# Altium schematic sheet I2S_Mic.SchDoc: FPGA Peripherals Board - MIC
size A4; Author: mayerph; DrawnBy: mayerph; Organization: IIS; Revision: PA; SheetNumber: 7; SheetTotal: 7
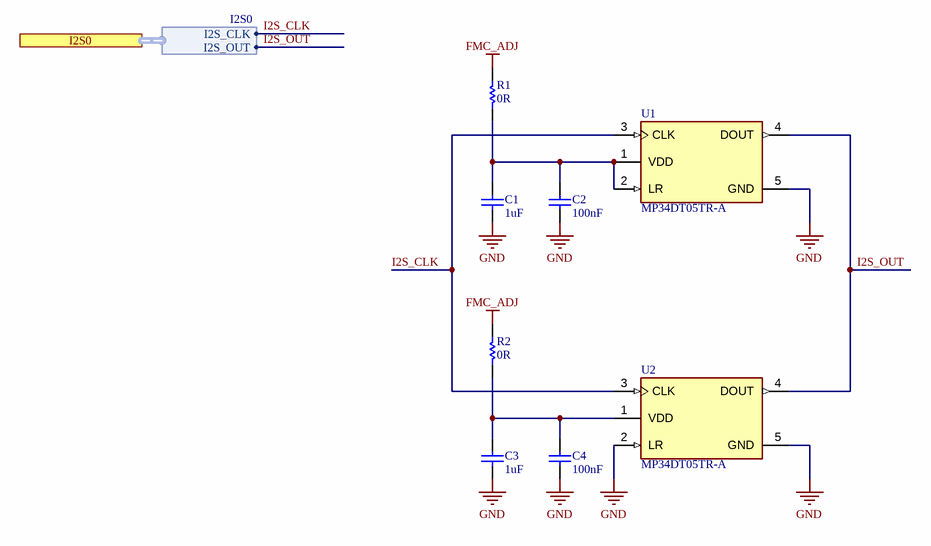
[diagram p0: I2S_Mic.SchDoc]

## Parts
C1  1uF  [CAPC1005X60X30LL05T10]
C2  100nF  [CAPC1050X55X23LL05T13]
C3  1uF  [CAPC1005X60X30LL05T10]
C4  100nF  [CAPC1050X55X23LL05T13]
R1  0R  [RESC1005X40X25LL05T10]
R2  0R  [RESC1005X40X25LL05T10]
U1  MP34DT05TR-A  [FP-HCLGA-DM00231908-MFG]
U2  MP34DT05TR-A  [FP-HCLGA-DM00231908-MFG]

## Ports
I2S0 (harness I2S0)

## Harnesses
I2S0: I2S_OUT, I2S_CLK

## Nets
FMC_ADJ: R1.2 R2.2
GND: C1.1 C2.1 C3.1 C4.1 U1.5(GND) U2.2(LR) U2.5(GND)
I2S_CLK: U1.3(CLK) U2.3(CLK) ; port I2S0.I2S_CLK
I2S_OUT: U1.4(DOUT) U2.4(DOUT) ; port I2S0.I2S_OUT
NetC1_2: C1.2 C2.2 R1.1 U1.1(VDD) U1.2(LR)
NetC3_2: C3.2 C4.2 R2.1 U2.1(VDD)

## Notes on the sheet
- 1
- 2
- 3
- 4
- A
- B
- C
- Project:
- D
- Date:
- Drawing number:
- Rev:
- Format:
- A4 Q
- Drawn by:
- Laboratory:
- Page
- Sheet:
- of
- File:

## Library data of the parts
C1 C3 = CMP-2008-02044-1: Part Number: C0402C105K9PACTU; Manufacturer: Kemet; Dielectric Material: Ceramic; Tolerance: 10%; Voltage Rating: 6.3V; Dielectric: X5R; Supplier 1: Digi-Key; Supplier Part Number 1: 399-4873-6-ND; Manufacturer Part Number: C0402C105K9PACTU; RoHS: Yes; Category: Ceramic Capacitors; Stock 1: 1737568; Pricing 1: 1=0.10000, 10=0.02600, 100=0.01180, 500=0.00844, 1000=0.00662, 2500=0.00602, 5000=0.00554 (USD); Mount: Surface Mount; Case/Package: 0402; Number of Pins: 2; Case Code (Imperial): 0402; Min Operating Temperature: -55°C; Max Operating Temperature: 85°C; Value: 1uF; Packaging: Tape and Reel; Voltage Rating (DC): 6.3V; Package Quantity: 1; Termination: SMD/SMT; Voltage: 6.3V; Length: 1mm; Height: 0.5mm; Width: 0.02inch; Thickness: 0.022inch; Depth: 0.5mm; Lead Pitch: 0.3mm; Radiation Hardening: No; Lead Free: Lead Free; REACH SVHC: No SVHC; ComponentLink1URL: https://datasheet.ciiva.com/28645/1789732-28645392.pdf?src-supplier=Element14; ComponentLink1Description: https://datasheet.ciiva.com/28645/1789732-28645392.pdf?src-supplier=Element14; ComponentLink2URL: https://datasheet.ciiva.com/11786/0900766b8116eb59-11786028.pdf?src-supplier=RSComponents; ComponentLink2Description: https://datasheet.ciiva.com/11786/0900766b8116eb59-11786028.pdf?src-supplier=RSComponents; ComponentLink3URL: https://datasheet.ciiva.com/7747/kem-c1006-x5r-smd-7747445.pdf?src-supplier=Element14; ComponentLink3Description: https://datasheet.ciiva.com/7747/kem-c1006-x5r-smd-7747445.pdf?src-supplier=Element14; ComponentLink4URL: https://datasheet.ciiva.com/7747/40889-7747623.pdf?src-supplier=Element14; ComponentLink4Description: https://datasheet.ciiva.com/7747/40889-7747623.pdf?src-supplier=Element14; ComponentLink5URL: https://datasheet.ciiva.com/18192/getdatasheetpartid-127800-18192427.pdf?src-supplier=Verical; ComponentLink5Description: https://datasheet.ciiva.com/18192/getdatasheetpartid-127800-18192427.pdf?src-supplier=Verical
C2 C4 = CMP-2000-05439-1: Chip Capacitor, 100 nF, +/- 10%, 16 V, -55 to 125 degC, 0402 (1005 Metric), RoHS, Tape and Reel; Manufacturer: Samsung Electro-Mechanics; Manufacturer Part Number: CL05B104KO5NNNC; Dielectric: X7R; Rated Voltage: 16V; Material: Ceramic; Case Size/Dimension: 0402; Tolerance (%): ±10%; Value: 100nF; Manufacturer URL: http://www.samsungsem.com/global/index.jsp; Datasheet URL: https://datasheet.ciiva.com/29198/458718-da-01-en-vs-kondensator-0402-29198423.pdf; Datasheet Version: Nov-10; Supplier 1: Digi-Key; Supplier Part Number 1: 1276-1001-1-ND; RoHS: Yes; Category: Ceramic Capacitors; Stock 1: 18886859; Pricing 1: 1=0.10000, 10=0.02800, 50=0.01520, 100=0.01240, 500=0.00886, 1000=0.00696, 2500=0.00632, 5000=0.00582 (USD); Mount: Surface Mount; Case/Package: 0402; Case Code (Metric): 1005; Case Code (Imperial): 0402; Contact Plating: Tin; Min Operating Temperature: -55°C; Max Operating Temperature: 125°C; Tolerance: 10%; Packaging: Tape and Reel; Voltage Rating: 16V; Voltage Rating (DC): 16V; Package Quantity: 1; Voltage: 16V; Length: 1mm; Height: 0.5mm; Width: 0.02inch; Depth: 0.5mm; Thickness: 0.022inch; Radiation Hardening: No; Lead Free: Lead Free; ComponentLink1URL: https://datasheet.ciiva.com/26920/getdatasheetpartid-359683-26920169.pdf?src-supplier=Verical; ComponentLink1Description: https://datasheet.ciiva.com/26920/getdatasheetpartid-359683-26920169.pdf?src-supplier=Verical; ComponentLink2URL: https://datasheet.ciiva.com/29198/458718-da-01-en-vs-kondensator-0402-29198423.pdf?src-supplier=Conrad; ComponentLink2Description: https://datasheet.ciiva.com/29198/458718-da-01-en-vs-kondensator-0402-29198423.pdf?src-supplier=Conrad; ComponentLink3URL: https://datasheet.ciiva.com/16208/cl05b104kq5nnnc-16208343.pdf?src-supplier=Future+Electronics; ComponentLink3Description: https://datasheet.ciiva.com/16208/cl05b104kq5nnnc-16208343.pdf?src-supplier=Future+Electronics; ComponentLink4URL: https://datasheet.ciiva.com/26309/mlcc-catalogdownload2013-eng-26309003.pdf?src-supplier=Distrelec; ComponentLink4Description: https://datasheet.ciiva.com/26309/mlcc-catalogdownload2013-eng-26309003.pdf?src-supplier=Distrelec
R1 R2 = CMP-2002-07912-1: Manufacturer: Yageo; Part Number: RC0402JR-070RL; Value: 0 Ohm; Power Rating: 62.5mW; Tolerance: 5%; Voltage Rating: 50V; Temperature Coefficient: 200ppm/°C; Max Power Dissipation: 63mW; Supplier 1: Digi-Key; Supplier Part Number 1: 311-0.0JRCT-ND; Manufacturer Part Number: RC0402JR-070RL; RoHS: Yes; Category: Chip SMD Resistors; Stock 1: 44193294; Pricing 1: 1=0.10000, 10=0.01200, 25=0.00840, 50=0.00640, 100=0.00480, 250=0.00364, 500=0.00292, 1000=0.00215, 5000=0.00154 (USD); Case/Package: 0402; Contact Plating: Tin,Matte; Case Code (Metric): 1005; Case Code (Imperial): 0402; Min Operating Temperature: -55°C; Max Operating Temperature: 155°C; Resistor Type: Thick Film; Packaging: Tape and Reel; Termination: SMD/SMT; Package Quantity: 1; Number of Terminations: 2; Features: Moisture Resistant; Length: 1mm; Height: 0.016inch; Width: 0.02inch; Depth: 0.5mm; Radiation Hardening: No; Lead Free: Lead Free; REACH SVHC: Unknown; Military Standard: Not; ComponentLink1URL: https://datasheet.ciiva.com/2452/pyu-rc0402-51-rohs-l-6-2452608.pdf?src-supplier=Digi-Key; ComponentLink1Description: https://datasheet.ciiva.com/2452/pyu-rc0402-51-rohs-l-6-2452608.pdf?src-supplier=Digi-Key; ComponentLink2URL: https://datasheet.ciiva.com/11808/0900766b80c66297-11808195.pdf?src-supplier=RSComponents; ComponentLink2Description: https://datasheet.ciiva.com/11808/0900766b80c66297-11808195.pdf?src-supplier=RSComponents; ComponentLink3URL: https://datasheet.ciiva.com/2452/pyu-r-int-thick-7-2452609.pdf?src-supplier=Digi-Key; ComponentLink3Description: https://datasheet.ciiva.com/2452/pyu-r-int-thick-7-2452609.pdf?src-supplier=Digi-Key; ComponentLink4URL: https://datasheet.ciiva.com/2452/pyu-r-int-thick-7-2452610.pdf?src-supplier=Digi-Key; ComponentLink4Description: https://datasheet.ciiva.com/2452/pyu-r-int-thick-7-2452610.pdf?src-supplier=Digi-Key; ComponentLink5URL: https://datasheet.ciiva.com/8896/pyu-rc0402-51-rohs-l-6-8896201.pdf?src-supplier=Avnet; ComponentLink5Description: https://datasheet.ciiva.com/8896/pyu-rc0402-51-rohs-l-6-8896201.pdf?src-supplier=Avnet; ComponentLink6URL: https://datasheet.ciiva.com/28386/pyu-rc0402-51-rohs-l-6-28386633.pdf?src-supplier=Avnet+Europe; ComponentLink6Description: https://datasheet.ciiva.com/28386/pyu-rc0402-51-rohs-l-6-28386633.pdf?src-supplier=Avnet+Europe; ComponentLink7URL: https://datasheet.ciiva.com/22747/1018594-22747515.pdf?src-supplier=Element14; ComponentLink7Description: https://datasheet.ciiva.com/22747/1018594-22747515.pdf?src-supplier=Element14; ComponentLink8URL: https://datasheet.ciiva.com/15189/getdatasheetpartid-326379-15189533.pdf?src-supplier=Verical; ComponentLink8Description: https://datasheet.ciiva.com/15189/getdatasheetpartid-326379-15189533.pdf?src-supplier=Verical; ComponentLink9URL: https://datasheet.ciiva.com/7983/1018594-7983535.pdf?src-supplier=Element14; ComponentLink9Description: https://datasheet.ciiva.com/7983/1018594-7983535.pdf?src-supplier=Element14
U1 U2 = CMP-12231-000001-1: MEMS AUD MIC SENSOR OMNI 4HCLGA; Manufacturer: STMicroelectronics; Min Supply Voltage: 1.6V; Max Supply Voltage: 3.6V; Operating Supply Voltage: 1.8V; Frequency: 2.4MHz; Direction: Omidirectional; Current: 650uA; Shape: Rectangular; Output Type: Digital; Sensing Method: Magnetic; Self Resonant Frequency: 850Hz; Impedance: 8R; Power Rating: 700mW; Max Power Dissipation: 1W; Ratings: IP67,Waterproof,Dust Tight; Lead Free: Yes; Digikey Description: MEMS AUD MIC SENSOR OMNI 4HCLGA; Device Class L1: Electromechanical; ComponentLink2Description: Datasheet; RoHS: TRUE; Temperature: -40°C to +85°C; Package: HCLGA-DM00231908; Device Class L2: Audio Products; Device Class L3: Microphones; Manufacturer Part Number: MP34DT05TR-A; Mouser Description: MP34DT05: 3.6 V MEMS Audio Sensor Omnidirectional Digital Microphone - HCLGA-4LD; Temperature Range Low: -40°C; ComponentLink2URL: https://www.st.com/resource/en/datasheet/mp34dt05-a.pdf; Octopart: https://octopart.com/mp34dt05tr-a-stmicroelectronics-87879016; Automotive: No; Height: 1.1mm; Temperature Range High: +85°C; Category: IC; Supplier 1: Digi-Key; Supplier Part Number 1: 497-17809-1-ND; Stock 1: 2737; Pricing 1: 1=1.21000, 10=1.00700, 25=0.93240, 50=0.87760, 100=0.82470, 500=0.70956, 1000=0.66330 (USD); Packaging: Tape and Reel; Voltage Rating: 1.8V; Termination: Solder; Operating Supply Current: 650uA; ComponentLink1URL: http://www.farnell.com/datasheets/2600073.pdf?src-supplier=Farnell; ComponentLink1Description: http://www.farnell.com/datasheets/2600073.pdf?src-supplier=Farnell; ComponentLink3URL: http://www.st.com/content/ccc/resource/technical/document/datasheet/group3/c7/90/d3/f6/b7/e7/40/c8/DM00415595/files/DM00415595.pdf/jcr:content/translations/en.DM00415595.pdf?src-supplier=Digi-Key; ComponentLink3Description: http://www.st.com/content/ccc/resource/technical/document/datasheet/group3/c7/90/d3/f6/b7/e7/40/c8/DM00415595/files/DM00415595.pdf/jcr:content/translations/en.DM00415595.pdf?src-supplier=Digi-Key; ComponentLink4URL: http://www.farnell.com/datasheets/2600073.pdf?src-supplier=Newark; ComponentLink4Description: http://www.farnell.com/datasheets/2600073.pdf?src-supplier=Newark; ComponentLink5URL: http://www.farnell.com/datasheets/2600073.pdf?src-supplier=Element14; ComponentLink5Description: http://www.farnell.com/datasheets/2600073.pdf?src-supplier=Element14